# Altium schematic sheet BMS_Main.SchDoc
size B
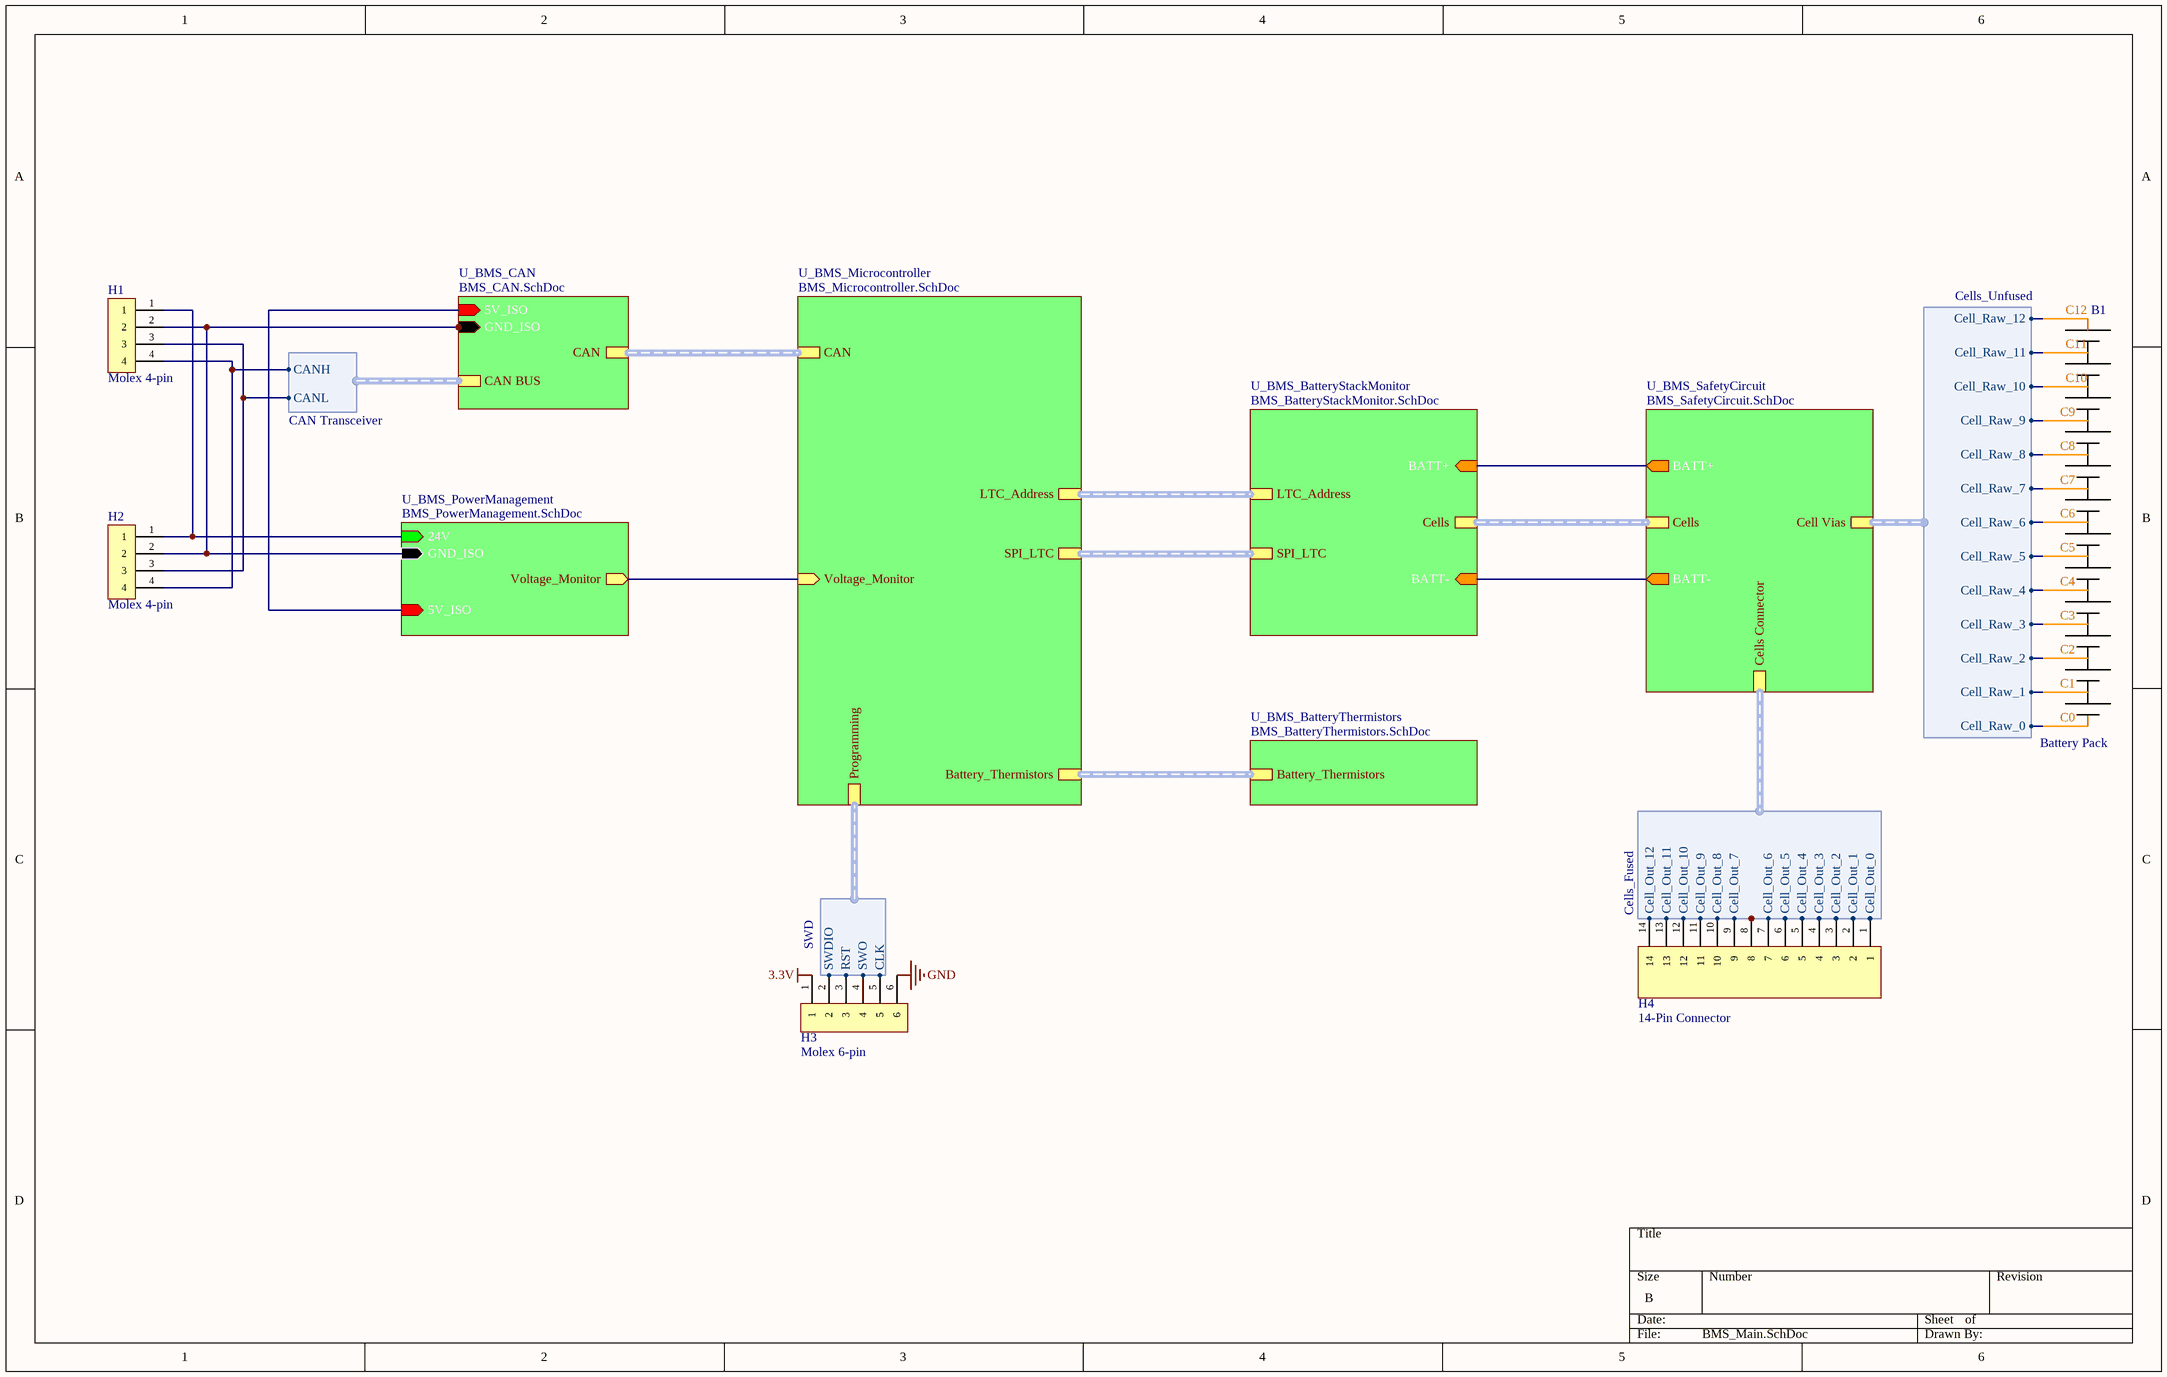
[diagram p0: BMS_Main.SchDoc]

## Parts
B1  Battery Pack  [Cells]
H1  Molex 4-pin  [Communication Connector]
H2  Molex 4-pin  [Communication Connector]
H3  Molex 6-pin  [ProgrammingConnector]
H4  14-Pin Connector  [CellConnector]

## Sub-sheets
U_BMS_BatteryStackMonitor = BMS_BatteryStackMonitor.SchDoc: Cells (harness Harness), BATT+ (in), SPI_LTC (harness SPI), BATT- (in), LTC_Address (harness Address)
U_BMS_BatteryThermistors = BMS_BatteryThermistors.SchDoc: Battery_Thermistors (harness Thermistors)
U_BMS_CAN = BMS_CAN.SchDoc: CAN (harness CAN Controller), CAN BUS (harness CAN Transceiver), GND_ISO (in), 5V_ISO (in)
U_BMS_Microcontroller = BMS_Microcontroller.SchDoc: CAN (harness CAN), Programming (harness SWD), SPI_LTC (harness SPI), Battery_Thermistors (harness Thermistors), LTC_Address (harness Address), Voltage_Monitor (in)
U_BMS_PowerManagement = BMS_PowerManagement.SchDoc: GND_ISO (in), Voltage_Monitor (out), 5V_ISO (in), 24V (in)
U_BMS_SafetyCircuit = BMS_SafetyCircuit.SchDoc: Cell Vias (harness Cells_Unfused), Cells Connector (harness Cells_Fused), Cells (harness Cells Switches), BATT+ (out), BATT- (out)

## Harnesses
CAN Transceiver: CANL, CANH
Cells_Unfused: Cell_Raw_0, Cell_Raw_1, Cell_Raw_2, Cell_Raw_3, Cell_Raw_4, Cell_Raw_5, Cell_Raw_6, Cell_Raw_7, Cell_Raw_8, Cell_Raw_9, Cell_Raw_10, Cell_Raw_11, Cell_Raw_12
Cells_Fused: Cell_Out_0, Cell_Out_1, Cell_Out_2, Cell_Out_3, Cell_Out_4, Cell_Out_5, Cell_Out_6, Cell_Out_7, Cell_Out_8, Cell_Out_9, Cell_Out_10, Cell_Out_11, Cell_Out_12
SWD: SWDIO, SWO, CLK, RST

## Nets
3.3V: H3.1
GND: H3.6
NetB1_0: B1.0 ; sheet U_BMS_SafetyCircuit/Cell Vias.Cell_Raw_0
NetB1_1: B1.1 ; sheet U_BMS_SafetyCircuit/Cell Vias.Cell_Raw_1
NetB1_2: B1.2 ; sheet U_BMS_SafetyCircuit/Cell Vias.Cell_Raw_2
NetB1_3: B1.3 ; sheet U_BMS_SafetyCircuit/Cell Vias.Cell_Raw_3
NetB1_4: B1.4 ; sheet U_BMS_SafetyCircuit/Cell Vias.Cell_Raw_4
NetB1_5: B1.5 ; sheet U_BMS_SafetyCircuit/Cell Vias.Cell_Raw_5
NetB1_6: B1.6 ; sheet U_BMS_SafetyCircuit/Cell Vias.Cell_Raw_6
NetB1_7: B1.7 ; sheet U_BMS_SafetyCircuit/Cell Vias.Cell_Raw_7
NetB1_8: B1.8 ; sheet U_BMS_SafetyCircuit/Cell Vias.Cell_Raw_8
NetB1_9: B1.9 ; sheet U_BMS_SafetyCircuit/Cell Vias.Cell_Raw_9
NetB1_10: B1.10 ; sheet U_BMS_SafetyCircuit/Cell Vias.Cell_Raw_10
NetB1_11: B1.11 ; sheet U_BMS_SafetyCircuit/Cell Vias.Cell_Raw_11
NetB1_12: B1.12 ; sheet U_BMS_SafetyCircuit/Cell Vias.Cell_Raw_12
NetH1_1: H1.1 H2.1 ; sheet U_BMS_PowerManagement/24V
NetH1_2: H1.2 H2.2 ; sheet U_BMS_CAN/GND_ISO, sheet U_BMS_PowerManagement/GND_ISO
NetH1_3: H1.3 H2.3 ; sheet U_BMS_CAN/CAN BUS.CANL
NetH1_4: H1.4 H2.4 ; sheet U_BMS_CAN/CAN BUS.CANH
NetH3_2: H3.2 ; sheet U_BMS_Microcontroller/Programming.SWDIO
NetH3_3: H3.3 ; sheet U_BMS_Microcontroller/Programming.RST
NetH3_4: H3.4 ; sheet U_BMS_Microcontroller/Programming.SWO
NetH3_5: H3.5 ; sheet U_BMS_Microcontroller/Programming.CLK
NetH4_1: H4.1 ; sheet U_BMS_SafetyCircuit/Cells Connector.Cell_Out_0
NetH4_2: H4.2 ; sheet U_BMS_SafetyCircuit/Cells Connector.Cell_Out_1
NetH4_3: H4.3 ; sheet U_BMS_SafetyCircuit/Cells Connector.Cell_Out_2
NetH4_4: H4.4 ; sheet U_BMS_SafetyCircuit/Cells Connector.Cell_Out_3
NetH4_5: H4.5 ; sheet U_BMS_SafetyCircuit/Cells Connector.Cell_Out_4
NetH4_6: H4.6 ; sheet U_BMS_SafetyCircuit/Cells Connector.Cell_Out_5
NetH4_7: H4.7 H4.8 ; sheet U_BMS_SafetyCircuit/Cells Connector.Cell_Out_6
NetH4_9: H4.9 ; sheet U_BMS_SafetyCircuit/Cells Connector.Cell_Out_7
NetH4_10: H4.10 ; sheet U_BMS_SafetyCircuit/Cells Connector.Cell_Out_8
NetH4_11: H4.11 ; sheet U_BMS_SafetyCircuit/Cells Connector.Cell_Out_9
NetH4_12: H4.12 ; sheet U_BMS_SafetyCircuit/Cells Connector.Cell_Out_10
NetH4_13: H4.13 ; sheet U_BMS_SafetyCircuit/Cells Connector.Cell_Out_11
NetH4_14: H4.14 ; sheet U_BMS_SafetyCircuit/Cells Connector.Cell_Out_12
(unnamed): sheet U_BMS_BatteryStackMonitor/BATT+, sheet U_BMS_SafetyCircuit/BATT+
(unnamed): sheet U_BMS_BatteryStackMonitor/BATT-, sheet U_BMS_SafetyCircuit/BATT-
(unnamed): sheet U_BMS_Microcontroller/Voltage_Monitor, sheet U_BMS_PowerManagement/Voltage_Monitor
(unnamed): sheet U_BMS_CAN/5V_ISO, sheet U_BMS_PowerManagement/5V_ISO

## Buses and harness runs
harness sheet U_BMS_BatteryStackMonitor/Cells = sheet U_BMS_SafetyCircuit/Cells
harness sheet U_BMS_BatteryStackMonitor/LTC_Address = sheet U_BMS_Microcontroller/LTC_Address
harness sheet U_BMS_BatteryStackMonitor/SPI_LTC = sheet U_BMS_Microcontroller/SPI_LTC
harness sheet U_BMS_BatteryThermistors/Battery_Thermistors = sheet U_BMS_Microcontroller/Battery_Thermistors
harness sheet U_BMS_CAN/CAN = sheet U_BMS_Microcontroller/CAN

## Notes on the sheet
- (in symbol Battery Pack) C12; C11; C10; C9; C8; C7; C6; C5; C4; C3; C2; C1; C0

## Library data of the parts
B1 = Battery Pack: 12s3p battery pack, LiFePO4 GH Battery Cell with 3.7V and 8Ah
H1 H2 = Molex 4-pin: Micro-Fit 3.0 Vertical Header, 3.00mm Pitch, Dual Row, 4 Circuits, with Solder Tab, Tin, Glow-Wire Capable, Black + Micro-Fit 3.0 Receptacle Housing, Dual Row, 4 Circuits, UL 94V-0, Low-Halogen, Black
H3 = Molex 6-pin: Micro-Fit 3.0 Vertical Header, 3.00mm Pitch, Dual Row, 6 Circuits, with Solder Tab, Tin, Glow-Wire Capable, Black + Micro-Fit 3.0 Receptacle Housing, Dual Row, 6 Circuits, UL 94V-0, Low-Halogen, Black
H4 = 14-Pin Connector: Micro-Fit 3.0 Right-Angle Header, 3.00mm Pitch, Dual Row, 14 Circuits, with Solder Tab, Tin, Glow-Wire Capable, Black + Micro-Fit 3.0 Receptacle Housing, Dual Row, 14 Circuits, UL 94V-0, Low-Halogen, Black